# Altium schematic sheet MCU.SchDoc
size A4
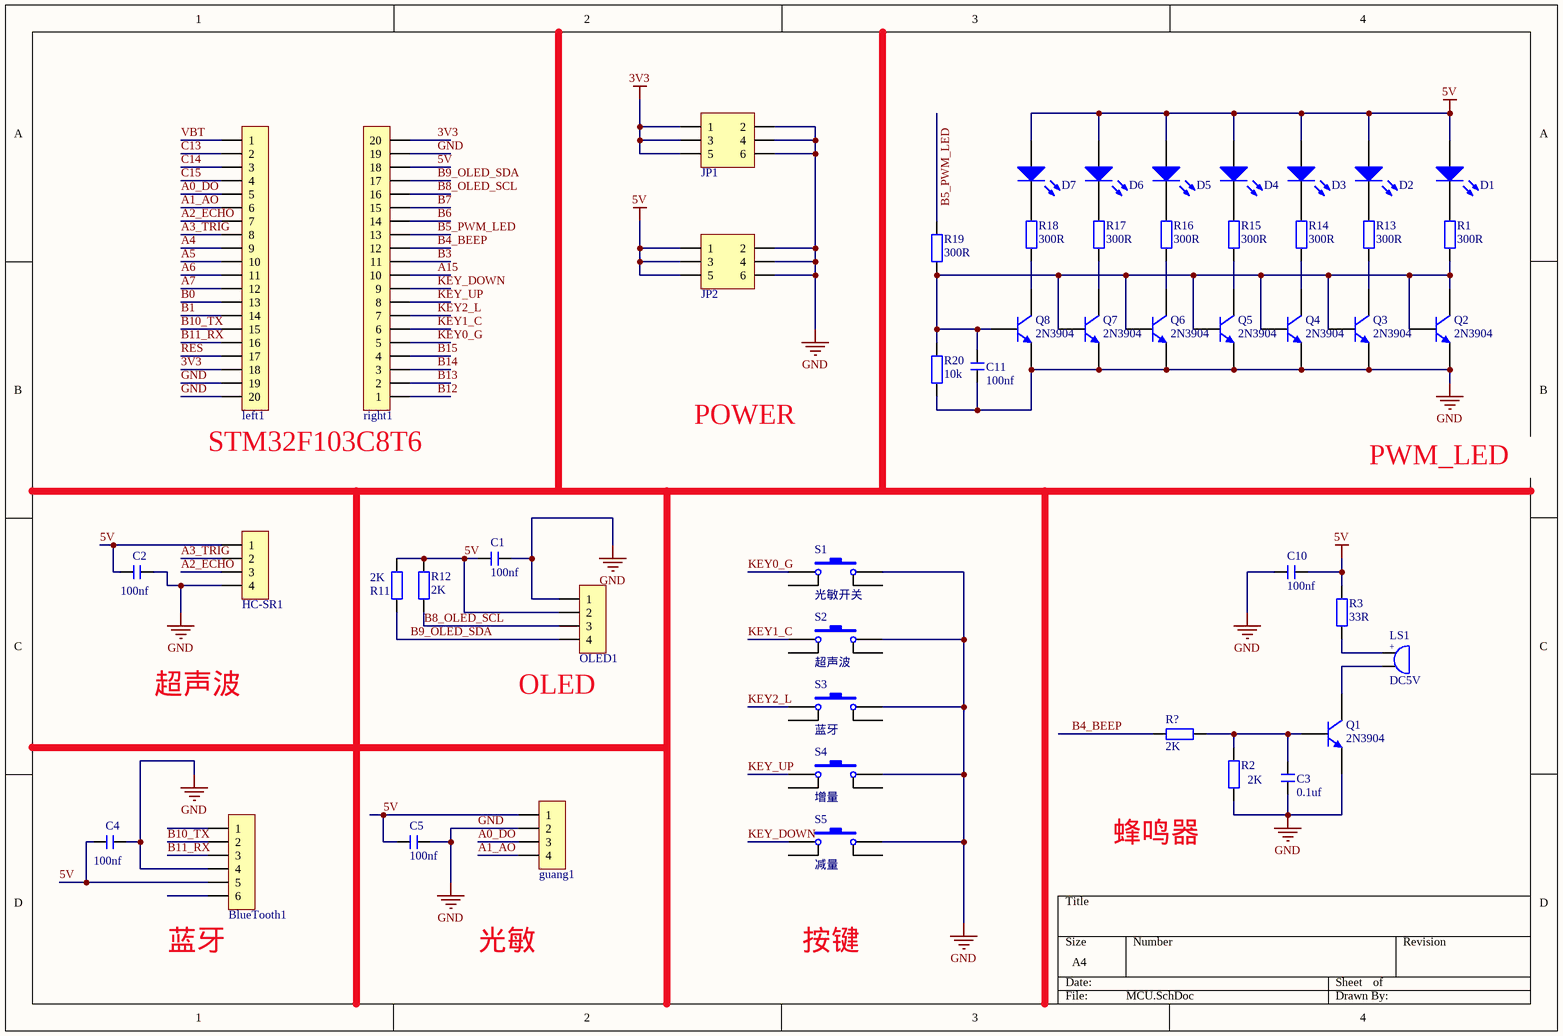
[diagram p0: MCU.SchDoc]

## Parts
BlueTooth1  HDR-1X6  [HDR2.54-LI-6P]  (value not drawn)
C1  100nf  [C 0805_L]
C2  100nf  [C 0805_L]
C3  0.1uf  [C 0805_L]
C4  100nf  [C 0805_L]
C5  100nf  [C 0805_L]
C10  100nf  [C 0805_L]
C11  100nf  [C 0805_L]
D1  LED  [LED_A2]  (value not drawn)
D2  LED  [LED_A2]  (value not drawn)
D3  LED  [LED_A2]  (value not drawn)
D4  LED  [LED_A2]  (value not drawn)
D5  LED  [LED_A2]  (value not drawn)
D6  LED  [LED_A2]  (value not drawn)
D7  LED  [LED_A2]  (value not drawn)
guang1  HDR-1X4  [HDR2.54-LI-4P]  (value not drawn)
HC-SR1  HDR-1X4  [HDR2.54-LI-4P]  (value not drawn)
JP1  Header3X2  [HDR2.54-LI-2x3P]  (value not drawn)
JP2  Header3X2  [HDR2.54-LI-2x3P]  (value not drawn)
left1  HDR-1X20  [HDR2.54-LI-20P]  (value not drawn)
LS1  DC5V  [BEEP 5x9x5.5]
OLED1  HDR-1X4  [HDR2.54-LI-4P]  (value not drawn)
Q1  2N3904  [TO-92A]
Q2  2N3904  [TO-92A]
Q3  2N3904  [TO-92A]
Q4  2N3904  [TO-92A]
Q5  2N3904  [TO-92A]
Q6  2N3904  [TO-92A]
Q7  2N3904  [TO-92A]
Q8  2N3904  [TO-92A]
R1  300R  [R 0805_L]
R2  2K  [R 0805_L]
R3  33R  [R 0805_L]
R11  2K  [R 0805_L]
R12  2K  [R 0805_L]
R13  300R  [R 0805_L]
R14  300R  [R 0805_L]
R15  300R  [R 0805_L]
R16  300R  [R 0805_L]
R17  300R  [R 0805_L]
R18  300R  [R 0805_L]
R19  300R  [R 0805_L]
R20  10k  [R 0805_L]
R?  2K  [R 0805_L]
right1  HDR-1X20  [HDR2.54-LI-20P]  (value not drawn)
S1  光敏开关  [SW_PB4_A1]
S2  超声波  [SW_PB4_A1]
S3  蓝牙  [SW_PB4_A1]
S4  增量  [SW_PB4_A1]
S5  减量  [SW_PB4_A1]

## Nets
3V3: JP1.1 JP1.3 JP1.5 left1.18 right1.20
5V: BlueTooth1.5 C1.2 C2.1 C4.1 C5.2 C10.1 D1.1(A) D2.1(A) D3.1(A) D4.1(A) D5.1(A) D6.1(A) D7.1(A) guang1.1 HC-SR1.1 JP2.1 JP2.3 JP2.5 OLED1.2 R3.2 R11.1 R12.1 right1.18
GND: BlueTooth1.4 C1.1 C2.2 C3.1 C4.2 C5.1 C10.2 C11.2 guang1.2 HC-SR1.4 JP1.2 JP1.4 JP1.6 JP2.2 JP2.4 JP2.6 left1.19 left1.20 OLED1.1 Q1.1(E) Q2.1(E) Q3.1(E) Q4.1(E) Q5.1(E) Q6.1(E) Q7.1(E) Q8.1(E) R2.2 R20.1 right1.19 S1.2 S2.2 S3.2 S4.2 S5.2
A0_DO: guang1.3 left1.5
A1_AO: guang1.4 left1.6
A2_ECHO: HC-SR1.3 left1.7
A3_TRIG: HC-SR1.2 left1.8
A4: left1.9
A5: left1.10
A6: left1.11
A7: left1.12
A15: right1.10
B0: left1.13
B1: left1.14
B3: right1.11
B4_BEEP: R?.2 right1.12
B5_PWM_LED: R19.1 right1.13
B6: right1.14
B7: right1.15
B8_OLED_SCL: OLED1.3 R12.2 right1.16
B9_OLED_SDA: OLED1.4 R11.2 right1.17
B10_TX: BlueTooth1.2 left1.15
B11_RX: BlueTooth1.3 left1.16
B12: right1.1
B13: right1.2
B14: right1.3
B15: right1.4
C13: left1.2
C14: left1.3
C15: left1.4
KEY0_G: right1.5 S1.1
KEY1_C: right1.6 S2.1
KEY2_L: right1.7 S3.1
KEY_DOWN: right1.9 S5.1
KEY_UP: right1.8 S4.1
RES: left1.17
VBT: left1.1
NetC3_2: C3.2 Q1.2(B) R2.1 R?.1
NetC11_1: C11.1 Q2.2(B) Q2.3(C) Q3.2(B) Q4.2(B) Q5.2(B) Q6.2(B) Q7.2(B) Q8.2(B) R1.1 R19.2 R20.2
NetD1_2: D1.2(K) R1.2
NetD2_2: D2.2(K) R13.2
NetD3_2: D3.2(K) R14.2
NetD4_2: D4.2(K) R15.2
NetD5_2: D5.2(K) R16.2
NetD6_2: D6.2(K) R17.2
NetD7_2: D7.2(K) R18.2
NetLS1_1: LS1.1 R3.1
NetLS1_2: LS1.2 Q1.3(C)
NetQ3_3: Q3.3(C) R13.1
NetQ4_3: Q4.3(C) R14.1
NetQ5_3: Q5.3(C) R15.1
NetQ6_3: Q6.3(C) R16.1
NetQ7_3: Q7.3(C) R17.1
NetQ8_3: Q8.3(C) R18.1

Not connected (* = marked no-connect by the designer): BlueTooth1 1 6; S1 3 4; S2 3 4; S3 3 4; S4 3 4; S5 3 4

## Notes on the sheet
- POWER
- STM32F103C8T6
- PWM_LED
- 超声波
- (near OLED1) OLED
- (near R2) 蜂鸣器
- (near BlueTooth1) 蓝牙
- 光敏
- 按键
- (in symbol BEEP) +

## Library data of the parts
BlueTooth1 = Header 6: 6P接插件; 版权归属: 封装库来自淘宝 ID：黄晶宝石; BOM名称: 6P接插件; 学习资源: https://shop463601444.taobao.com
C1-C5 C10 C11 = C: 贴片电容; BOM名称: 无极性贴片电容; 淘宝ID: 封装库来自淘宝 ID：黄晶宝石; 联系售后，技术支持: https://shop463601444.taobao.com; 唯一出售店铺网址: https://shop463601444.taobao.com
D1-D7 = LED: 发光二极管; 技术支持，联系售后: https://shop463601444.taobao.com
guang1 HC-SR1 OLED1 = Header 4: 4P接插件; 版权归属: 封装库来自淘宝 ID：黄晶宝石; BOM名称: 4P接插件; 学习资源: https://shop463601444.taobao.com
JP1 JP2 = Header 3X2: 3*2P接插件; 版权归属: 封装库来自淘宝 ID：黄晶宝石; BOM名称: 3*2P接插件; 学习资源: https://shop463601444.taobao.com
left1 right1 = Header 20: 20P接插件; 版权归属: 封装库来自淘宝 ID：黄晶宝石; BOM名称: 20P接插件; 学习资源: https://shop463601444.taobao.com
LS1 = BEEP: 蜂鸣器; 版权归属: 封装库来自淘宝 ID：黄晶宝石; BOM名称: 蜂鸣器; 技术支持，联系售后: https://shop463601444.taobao.com
Q1-Q8 = 2N3904: NPN General Purpose Amplifier; Published: 8-Jun-2000; LatestRevisionDate: 15-Jan-2003; LatestRevisionNote: PCB Footprint 'BCY-W3/D4.7' replaced; DatasheetVersion: 1997; PackageVersion: Sep-1998; PackageReference: TO-92A; Publisher: Altium Limited; PackageDescription: TO, Flat Index; 3 In-Line, Axial Leads; Body Dia. 4.5mm; Leads 0.51 x 0.48 mm (max); ComponentLink1Description: Manufacturer Link; ComponentLink1URL: http://www.fairchildsemi.com/; ComponentLink2Description: Datasheet; ComponentLink2URL: http://www.fairchildsemi.com/ds/2N%2F2N3904.pdf
R1-R3 R11-R20 R? = R: 贴片电阻; 版权归属: 来自淘宝 ID：黄晶宝石; 封装库来自淘宝卖家 ID：黄晶宝石: 其他店铺购入均为盗版，不享受售后技术支持服务，请立即申请退款; BOM名称: 贴片电阻; 联系售后: https://shop463601444.taobao.com
S1-S5 = SW-PB4: 微动开关; Published: 24-Mar-1999; LatestRevisionDate: 17-Jul-2002; LatestRevisionNote: Re-released for DXP Platform.; PackageReference: SPST-2; Publisher: Altium Limited